# Altium schematic sheet connectors.SchDoc: AI ARTIQ Driver
size 420 x 297 mm; Author: G.Kasprowicz; CompanyName: CTI; Organization: CTI; Address1: CTI; Address2: Nowowiejska 15/19 00-665 Warsaw; Address3: gkasprow@gmail.com; DocumentNumber: 4; Revision: 1.0; SheetNumber: 4; SheetTotal: 11; ModifiedBy: -; CheckedDate: -; Title2: connectors; DivGrp: CTI; ModifiedDate: -; ProjectName: Sensor Box
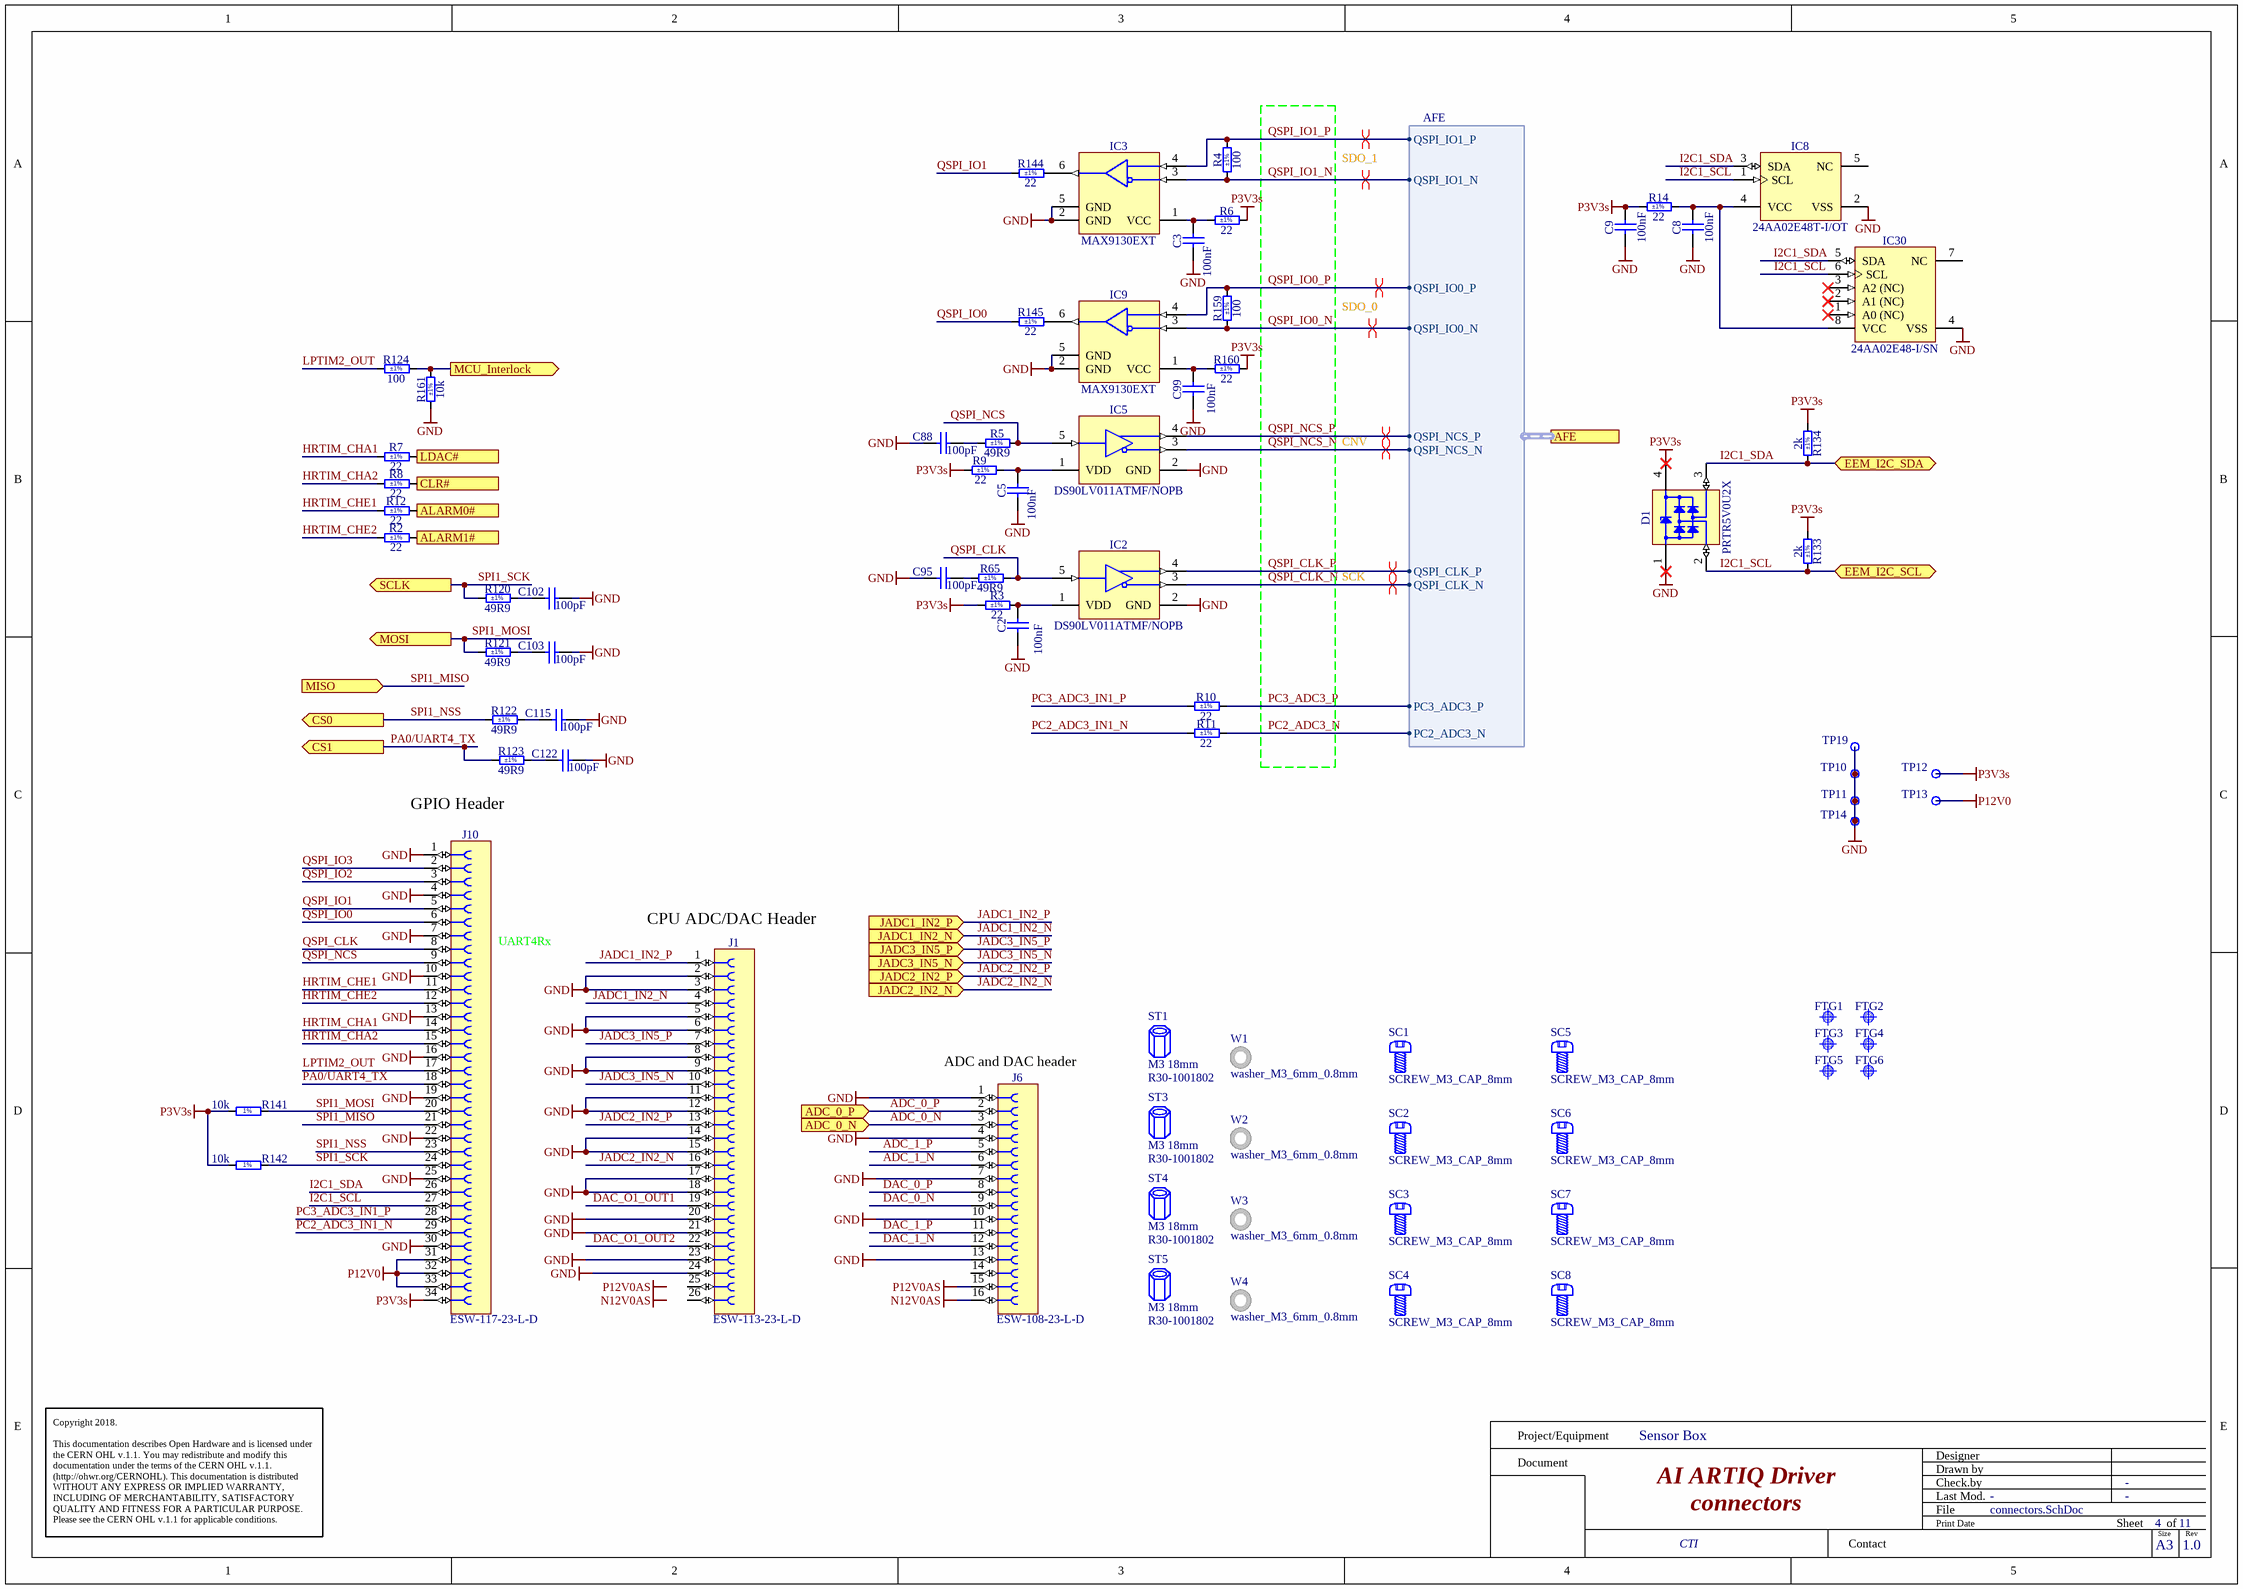
[diagram p0: connectors.SchDoc]

## Parts
C2  100nF  [CAPC2012X135N]
C3  100nF  [CAPC2012X135N]
C5  100nF  [CAPC2012X135N]
C8  100nF  [CAPC2012X135N]
C9  100nF  [CAPC2012X135N]
C88  100pF  [CAPC1005X55N]
C95  100pF  [CAPC1005X55N]
C99  100nF  [CAPC2012X135N]
C102  100pF  [CAPC1005X55N]
C103  100pF  [CAPC1005X55N]
C115  100pF  [CAPC1005X55N]
C122  100pF  [CAPC1005X55N]
D1  PRTR5V0U2X  [SOT190P230X110-4N]
FTG1  Use only in PCB  [FIDUCIAL_TOP_C100-200]  (value not drawn)  (no BOM)
FTG2  Use only in PCB  [FIDUCIAL_TOP_C100-200]  (value not drawn)  (no BOM)
FTG3  Use only in PCB  [FIDUCIAL_TOP_C100-200]  (value not drawn)  (no BOM)
FTG4  Use only in PCB  [FIDUCIAL_TOP_C100-200]  (value not drawn)  (no BOM)
FTG5  Use only in PCB  [FIDUCIAL_TOP_C100-200]  (value not drawn)  (no BOM)
FTG6  Use only in PCB  [FIDUCIAL_TOP_C100-200]  (value not drawn)  (no BOM)
IC2  DS90LV011ATMF/NOPB  [SOT95P284X122-5N]
IC3  MAX9130EXT  [SOT65P210X110-6N]
IC5  DS90LV011ATMF/NOPB  [SOT95P284X122-5N]
IC8  24AA02E48T-I/OT  [SOT95P280X145-5N]
IC9  MAX9130EXT  [SOT65P210X110-6N]
IC30  24AA02E48-I/SN  [SOIC127P600X175-8N]
J1  ESW-113-23-L-D  [ESW-113-23-L-D]
J6  ESW-108-23-L-D  [ESW-108-23-L-D]
J10  ESW-117-23-L-D  [ESW-117-23-L-D]
R2  22  Tolerance: ±1%  [RESC1608X55N]
R3  22  Tolerance: ±1%  [RESC1608X55N]
R4  100  Tolerance: ±1%  [RESC1608X55N]
R5  49R9  Tolerance: ±1%  [RESC1005X40N]
R6  22  Tolerance: ±1%  [RESC1608X55N]
R7  22  Tolerance: ±1%  [RESC1608X55N]
R8  22  Tolerance: ±1%  [RESC1608X55N]
R9  22  Tolerance: ±1%  [RESC1608X55N]
R10  22  Tolerance: ±1%  [RESC1608X55N]
R11  22  Tolerance: ±1%  [RESC1608X55N]
R12  22  Tolerance: ±1%  [RESC1608X55N]
R14  22  Tolerance: ±1%  [RESC1608X55N]
R65  49R9  Tolerance: ±1%  [RESC1005X40N]
R120  49R9  Tolerance: ±1%  [RESC1005X40N]
R121  49R9  Tolerance: ±1%  [RESC1005X40N]
R122  49R9  Tolerance: ±1%  [RESC1005X40N]
R123  49R9  Tolerance: ±1%  [RESC1005X40N]
R124  100  Tolerance: ±1%  [RESC1005X40N]
R133  2k  Tolerance: ±1%  [RESC1608X55N]
R134  2k  Tolerance: ±1%  [RESC1608X55N]
R141  10k  [RESC1005X40N]
R142  10k  [RESC1005X40N]
R144  22  Tolerance: ±1%  [RESC1608X55N]
R145  22  Tolerance: ±1%  [RESC1608X55N]
R159  100  Tolerance: ±1%  [RESC1608X55N]
R160  22  Tolerance: ±1%  [RESC1608X55N]
R161  10k  Tolerance: ±1%  [RESC1005X40N]
SC1  SCREW_M3_CAP_8mm  [SCREW_M3_CAP_8mm]  (mechanical)
SC2  SCREW_M3_CAP_8mm  [SCREW_M3_CAP_8mm]  (mechanical)
SC3  SCREW_M3_CAP_8mm  [SCREW_M3_CAP_8mm]  (mechanical)
SC4  SCREW_M3_CAP_8mm  [SCREW_M3_CAP_8mm]  (mechanical)
SC5  SCREW_M3_CAP_8mm  [SCREW_M3_CAP_8mm]  (mechanical)
SC6  SCREW_M3_CAP_8mm  [SCREW_M3_CAP_8mm]  (mechanical)
SC7  SCREW_M3_CAP_8mm  [SCREW_M3_CAP_8mm]  (mechanical)
SC8  SCREW_M3_CAP_8mm  [SCREW_M3_CAP_8mm]  (mechanical)
ST1  M3 18mm  [R30-1001802]  (mechanical)
ST3  M3 18mm  [R30-1001802]  (mechanical)
ST4  M3 18mm  [R30-1001802]  (mechanical)
ST5  M3 18mm  [R30-1001802]  (mechanical)
TP10  Test Point  [TPS127]  (value not drawn)  (no BOM)
TP11  Test Point  [TPS127]  (value not drawn)  (no BOM)
TP12  Test Point  [TPS127]  (value not drawn)  (no BOM)
TP13  Test Point  [TPS127]  (value not drawn)  (no BOM)
TP14  Test Point  [TPS127]  (value not drawn)  (no BOM)
TP19  Test Point  [VERO_20-313145]  (value not drawn)
W1  washer_M3_6mm_0.8mm  [washer_M3_6mm_0.8mm]  (mechanical)
W2  washer_M3_6mm_0.8mm  [washer_M3_6mm_0.8mm]  (mechanical)
W3  washer_M3_6mm_0.8mm  [washer_M3_6mm_0.8mm]  (mechanical)
W4  washer_M3_6mm_0.8mm  [washer_M3_6mm_0.8mm]  (mechanical)

## Ports
ADC_0_N (in), ADC_0_P (in), AFE (harness AFE), ALARM0# (in), ALARM1# (in), CLR# (out), CS0 (out), CS1 (out), EEM_I2C_SCL (bidir), EEM_I2C_SDA (bidir), JADC1_IN2_N (in), JADC1_IN2_P (in), JADC2_IN2_N (in), JADC2_IN2_P (in), JADC3_IN5_N (in), JADC3_IN5_P (in), LDAC# (out), MCU_Interlock (out), MISO (in), MOSI (out), SCLK (out)

## Harnesses
AFE: QSPI_IO1_P, QSPI_IO1_N, QSPI_IO0_P, QSPI_IO0_N, QSPI_NCS_P, QSPI_NCS_N, QSPI_CLK_P, QSPI_CLK_N, PC3_ADC3_P, PC2_ADC3_N

## Nets
GND: C2.1 C3.1 C5.1 C8.1 C9.1 C88.1 C95.1 C99.1 C102.2 C103.2 C115.2 C122.2 D1.1(GND) IC2.2(GND) IC3.2(GND) IC3.5(GND) IC5.2(GND) IC8.2(VSS) IC9.2(GND) IC9.5(GND) IC30.4(VSS) J1.2 J1.3 J1.5 J1.6 J1.8 J1.9 J1.11 J1.12 J1.14 J1.15 J1.17 J1.18 J1.20 J1.21 J1.23 J1.24 J6.1 J6.4 J6.7 J6.10 J6.13 J10.1 J10.4 J10.7 J10.10 J10.13 J10.16 J10.19 J10.22 J10.25 J10.30 R161.1 TP10.1 TP11.1 TP14.1 TP19.1
N12V0AS: J6.16
P3V3s: C9.2 D1.4(VCC) J10.34 R3.1 R6.2 R9.2 R14.1 R133.1 R134.1 R141.1 R142.1 R160.2 TP12.1
P12V0: J10.31 J10.32 J10.33 TP13.1
P12V0AS: J6.15
ADC_0_N: J6.3 ; port ADC_0_N
ADC_0_P: J6.2 ; port ADC_0_P
ADC_1_N: J6.6
ADC_1_P: J6.5
ALARM0#: R12.2 ; port ALARM0#
ALARM1#: R2.2 ; port ALARM1#
CLR#: R8.2 ; port CLR#
DAC_0_N: J6.9
DAC_0_P: J6.8
DAC_1_N: J6.12
DAC_1_P: J6.11
DAC_O1_OUT1: J1.19
DAC_O1_OUT2: J1.22
HRTIM_CHA1: J10.14 R7.1
HRTIM_CHA2: J10.15 R8.1
HRTIM_CHE1: J10.11 R12.1
HRTIM_CHE2: J10.12 R2.1
I2C1_SCL: D1.2(I/O1) IC8.1(SCL) IC30.6(SCL) J10.27 R133.2 ; port EEM_I2C_SCL
I2C1_SDA: D1.3(I/O2) IC8.3(SDA) IC30.5(SDA) J10.26 R134.2 ; port EEM_I2C_SDA
JADC1_IN2_N: J1.4 ; port JADC1_IN2_N
JADC1_IN2_P: J1.1 ; port JADC1_IN2_P
JADC2_IN2_N: J1.16 ; port JADC2_IN2_N
JADC2_IN2_P: J1.13 ; port JADC2_IN2_P
JADC3_IN5_N: J1.10 ; port JADC3_IN5_N
JADC3_IN5_P: J1.7 ; port JADC3_IN5_P
LDAC#: R7.2 ; port LDAC#
LPTIM2_OUT: J10.17 R124.1
MCU_Interlock: R124.2 R161.2 ; port MCU_Interlock
PA0/UART4_TX: J10.18 R123.1 ; port CS1
PC2_ADC3_IN1_N: J10.29 R11.1
PC2_ADC3_N: R11.2 ; port AFE.PC2_ADC3_N
PC3_ADC3_IN1_P: J10.28 R10.1
PC3_ADC3_P: R10.2 ; port AFE.PC3_ADC3_P
QSPI_CLK: IC2.5(TTLIN) J10.8 R65.2
QSPI_CLK_N: IC2.3(OUT-) ; port AFE.QSPI_CLK_N
QSPI_CLK_P: IC2.4(OUT+) ; port AFE.QSPI_CLK_P
QSPI_IO0: J10.6 R145.1
QSPI_IO0_N: IC9.3(IN-) R159.1 ; port AFE.QSPI_IO0_N
QSPI_IO0_P: IC9.4(IN+) R159.2 ; port AFE.QSPI_IO0_P
QSPI_IO1: J10.5 R144.1
QSPI_IO1_N: IC3.3(IN-) R4.1 ; port AFE.QSPI_IO1_N
QSPI_IO1_P: IC3.4(IN+) R4.2 ; port AFE.QSPI_IO1_P
QSPI_IO2: J10.3
QSPI_IO3: J10.2
QSPI_NCS: IC5.5(TTLIN) J10.9 R5.2
QSPI_NCS_N: IC5.3(OUT-) ; port AFE.QSPI_NCS_N
QSPI_NCS_P: IC5.4(OUT+) ; port AFE.QSPI_NCS_P
SPI1_MISO: J10.21 ; port MISO
SPI1_MOSI: J10.20 R121.1 R141.2 ; port MOSI
SPI1_NSS: J10.23 R122.1 ; port CS0
SPI1_SCK: J10.24 R120.1 R142.2 ; port SCLK
NetC2_2: C2.2 IC2.1(VDD) R3.2
NetC3_2: C3.2 IC3.1(VCC) R6.1
NetC5_2: C5.2 IC5.1(VDD) R9.1
NetC8_2: C8.2 IC8.4(VCC) IC30.8(VCC) R14.2
NetC88_2: C88.2 R5.1
NetC95_2: C95.2 R65.1
NetC99_2: C99.2 IC9.1(VCC) R160.1
NetC102_1: C102.1 R120.2
NetC103_1: C103.1 R121.2
NetC115_1: C115.1 R122.2
NetC122_1: C122.1 R123.2
NetIC3_6: IC3.6(OUT) R144.2
NetIC9_6: IC9.6(OUT) R145.2

Not connected (* = marked no-connect by the designer): IC8 5(NC); IC30 1(A0_(NC))* 2(A1_(NC))* 3(A2_(NC))* 7(NC); J1 25 26; J6 14

## Layout directives
differential pair: QSPI_CLK_N, QSPI_CLK_P, QSPI_IO0_N, QSPI_IO0_P, QSPI_IO1_N, QSPI_IO1_P, QSPI_NCS_N, QSPI_NCS_P

## Notes on the sheet
- SDO_1
- SDO_0
- CNV
- SCK
- GPIO Header
- (near J1) CPU ADC/DAC Header
- (near J10) UART4Rx
- (near J6) ADC and DAC header
- Labels drawn without touching a wire or pin: N12V0AS, P12V0AS
- Project/Equipment
- Document
- Designer
- Drawn by
- Check.by
- Copyright 2018.
  This documentation describes Open Hardware and is licensed under the CERN OHL v.1.1. You may redistribute and modify this documentation under the terms of the CERN OHL v.1.1. (http://ohwr.org/CERNOHL). This documentation is distributed WITHOUT ANY EXPRESS OR IMPLIED WARRANTY, INCLUDING OF MERCHANTABILITY, SATISFACTORY QUALITY AND FITNESS FOR A PARTICULAR PURPOSE. Please see the CERN OHL v.1.1 for applicable conditions.
- Contact
- File
- Last Mod.
- Print Date
- Sheet
- Size
- A3
- of
- Rev
- (in symbol R0402_10K_1%_0.0625W_100PPM) 1%

## Library data of the parts
C2 C3 C5 C8 C9 C99 = CC0805_100NF_50V_10%_X7R: Non-polarised capacitor; Part Description: SMD Multilayer Chip Ceramic Capacitor; Manufacturer: GENERIC; Manufacturer1 Part Number: C2012X7R1H104K085AA; Voltage: 50V; TC: X7R; Tolerance: ±10%; Part Number: CC0805_100NF_50V_10%_X7R; Component Kind: Standard; Component Type: Standard; Pin Count: 2; Value: 100nF; Status: Preferred; Manufacturer Part Number: CC0805_100NF_50V_10%_X7R; Case: 0805; Mounted: Yes; Socket: No; SMD: Yes; Sense: No; Manufacturer1 Example: TDK; Manufacturer1 ComponentHeight: 1mm; HelpURL: \\cern.ch\dfs\Applications\Altium\Datasheets\CC0805_X7R_TDK_C.pdf; Author: CERN DEM JLC; CreateDate: 03.12.2007; LatestRevisionDate: 22.04.2015
C88 C95 C102 C103 C115 C122 = CC0402_100PF_50V_5%_C0G: Non-polarised capacitor; Part Description: SMD Multilayer Chip Ceramic Capacitor; Manufacturer: GENERIC; Manufacturer1 Part Number: C0402C101J5GACTU; Voltage: 50V; TC: C0G/NP0; Tolerance: ±5%; Part Number: CC0402_100PF_50V_5%_C0G; Component Kind: Standard; Component Type: Standard; Pin Count: 2; Value: 100pF; Status: Preferred; Manufacturer Part Number: CC0402_100PF_50V_5%_C0G; Case: 0402; Mounted: Yes; Socket: No; SMD: Yes; Sense: No; Manufacturer1 Example: KEMET; Manufacturer1 ComponentHeight: 0.55mm; HelpURL: \\cern.ch\dfs\Applications\Altium\Datasheets\CC0402_C0G_KEMET_(Commercial Grade).pdf; Author: CERN DEM JLC; CreateDate: 03.12.2007; LatestRevisionDate: 22.04.2015
D1 = PRTR5V0U2X: Ultra Low Capacitance Double Rail-to-Rail ESD Protection Diode; Part Description: Ultra Low Capacitance (1pF) Double Rail-to-Rail ESD Protection Diode (8kV); Manufacturer: NXP SEMICONDUCTORS; Voltage: 5.5V; PressFit: No; Bonding: No; Part Number: PRTR5V0U2X; Component Kind: Standard; Component Type: Standard; Device: PRTR5V0U2X; PackageDescription: SOT143B, SOT, 1.90mm Pitch; 4 Pin, 1.30mm W X 2.90mm L X 1.10mm H body, IPC Medium Density; Manufacturer Part Number: PRTR5V0U2X; Pin Count: 4; Case: SOT143B; Mounted: Yes; Socket: No; SMD: Yes; Sense: No; ComponentHeight: 1.1mm; HelpURL: \\cern.ch\dfs\Applications\Altium\Datasheets\PRTR5V0U2X.pdf; Author: CERN DEM JLC; CreateDate: 22.03.2011; LatestRevisionDate: 22.03.2011
FTG1-FTG6 = FIDUCIAL_TARGET_C100-200: Fiducial Target; Part Description: Round Fiducial Target, Top Layer, 1.0mm, Top Solder 2.0mm, Keepout =2.0mm; Mounted: No; Part Number: FIDUCIAL_TARGET_C100-200; Component Type: Standard (No BOM); Pin Count: 1; Family: Fiducial; Socket: No; SMD: Yes; Sense: No; Status: None; ComponentHeight: 0mm; HelpURL: Undefined; Author: CERN DEM JLC; CreateDate: 09/02/2010; LatestRevisionDate: 04/04/2012; PackageDescription: Round Fiducial Target, Top Layer, 1.0mm, Top Solder 2.0mm, Keepout =2.0mm
IC2 IC5 = DS90LV011ATMF/NOPB: 3V LVDS Single High Speed Differential Driver; Manufacturer: NATIONAL SEMICONDUCTOR; PressFit: No; Bonding: No; Part Number: DS90LV011ATMF/NOPB; Component Kind: Standard; Component Type: Standard; Device: DS90LV011ATMF/NOPB; PackageDescription: SOT, 0.95mm Pitch; 5 Pin, 1.67mm W X 2.99mm L X 1.22mm H body, IPC Medium Density; Part Description: 3V LVDS Single High Speed Differential Driver; Manufacturer Part Number: DS90LV011ATMF; Pin Count: 5; Case: SOT23-5; Mounted: Yes; Socket: No; SMD: Yes; Sense: No; ComponentHeight: 1.19mm; Author: CERN DEM JLC; HelpURL: \\cern.ch\dfs\Applications\Altium\Datasheets\DS90LV011ATMF-NOPB.pdf; CreateDate: 25.04.2012; LatestRevisionDate: 01.06.2022
IC3 IC9 = MAX9130EXT: Single 500Mbps LVDS Line Receiver; Manufacturer: MAXIM; PressFit: No; Bonding: No; Part Number: MAX9130EXT; Component Kind: Standard; Component Type: Standard; Device: MAX9130EXT; PackageDescription: SOT363, SC70-6, SOT, 0.65mm Pitch, 6 Pin, 1.25mm W X 2.00mm L X 1.10mm H, IPC Medium Density; Part Description: Single 500Mbps LVDS Line Receiver; Manufacturer Part Number: MAX9130EXT; Pin Count: 6; Case: SOT363; Mounted: Yes; Socket: No; SMD: Yes; Sense: No; ComponentHeight: 1.1mm; Author: CERN DEM HF; HelpURL: \\cern.ch\dfs\Applications\Altium\Datasheets\MAX9130EXT.pdf; CreateDate: 18.05.2022; LatestRevisionDate: 18.05.2022
IC8 = 24AA02E48T-I/OT: 1.7V-5.5V, 2K I2C Serial EEPROM With EUI-48 Node Identity; Manufacturer: MICROCHIP TECHNOLOGY; PressFit: No; Bonding: No; Part Number: 24AA02E48T-I/OT; Component Kind: Standard; Component Type: Standard; Device: 24AA02E48T-I/OT; PackageDescription: SOT, 0.95mm pitch; 5 pin, 1.60mm W X 2.90mm L X 1.45mm H body, IPC Medium Density; Part Description: 1.7V-5.5V, 2K I2C Serial EEPROM With EUI-48 Node Identity; Manufacturer Part Number: 24AA02E48T-I/OT; Pin Count: 5; Case: SOT23-5; Mounted: Yes; Socket: No; SMD: Yes; Sense: No; ComponentHeight: 1.45mm; HelpURL: \\cern.ch\dfs\Applications\Altium\Datasheets\24AA02E48T-I-OT.pdf; Author: CERN DEM MR; CreateDate: 31.03.2016; LatestRevisionDate: 31.03.2016
IC30 = MEM_24AA02E48-I/SN: 1.7V-5.5V, 2K I2C™ Serial EEPROMs with EUI-48™ Node Identity; Manufacturer: MICROCHIP TECHNOLOGY; PressFit: No; Bonding: No; Part Number: 24AA02E48-I/SN; Component Kind: Standard; Component Type: Standard; Device: 24AA02E48-I/SN; PackageDescription: SOIC, 1.27mm Pitch; 8 Pin - Body 4x5mm, IPC Medium Density; Part Description: 1.7V-5.5V, 2K I2C™ Serial EEPROMs with EUI-48™ Node Identity; Manufacturer Part Number: 24AA02E48-I/SN; Pin Count: 8; Case: SOIC8; Mounted: Yes; Socket: No; SMD: Yes; Sense: No; ComponentHeight: 1.75mm; HelpURL: \\cern.ch\dfs\Applications\Altium\Datasheets\24AA025E48-I-SN.pdf; Author: CERN DEM MR; CreateDate: 19.07.2016; LatestRevisionDate: 19.07.2016
J1 = ESW-113-23-L-D: Connector Elevated Socket 26 POS 2.54mm, 13.59mm height; Manufacturer: Samtec; Manufacturer Part Number: ESW-113-23-L-D
J6 = ESW-108-23-L-D: Connector Elevated Socket 16 POS 2.54mm, 13.59mm height; Manufacturer: Samtec; Manufacturer Part Number: ESW-108-23-L-D
J10 = ESW-117-23-L-D: Connector Elevated Socket 34 POS 2.54mm, 13.59mm height; Manufacturer: Samtec; Manufacturer Part Number: ESW-117-23-L-D
R2 R3 R6-R12 R14 R144 R145 R160 = R0603_22R_1%_0.1W_100PPM: Resistor - 1%; Part Description: General Purpose Thick Film Chip Resistor; Manufacturer: GENERIC; Manufacturer1 Part Number: NRC06F22R0TRF; Power: 0.1W; TC: ±100ppm/°C; PressFit: No; Part Number: R0603_22R_1%_0.1W_100PPM; Component Kind: Standard; Component Type: Standard; Pin Count: 2; Value: 22; Status: Preferred; Manufacturer Part Number: R0603_22R_1%_0.1W_100PPM; Case: 0603; Mounted: Yes; Sense: No; Socket: No; SMD: Yes; Manufacturer1 Example: NIC COMPONENT; Manufacturer1 ComponentHeight: 0.55mm; HelpURL: \\cern.ch\dfs\Applications\Altium\Datasheets\R0603_NIC_NRC.pdf; Author: CERN DEM JLC; CreateDate: 03.12.2007; LatestRevisionDate: 13.03.2008
R4 R159 = R0603_100R_1%_0.1W_100PPM: Resistor - 1%; Part Description: General Purpose Thick Film Chip Resistor; Manufacturer: GENERIC; Manufacturer1 Part Number: NRC06F4700TRF; Power: 0.1W; TC: ±100ppm/°C; PressFit: No; Part Number: R0603_100R_1%_0.1W_100PPM; Component Kind: Standard; Component Type: Standard; Pin Count: 2; Value: 100; Status: Preferred; Manufacturer Part Number: R0603_100R_1%_0.1W_100PPM; Case: 0603; Mounted: Yes; Sense: No; Socket: No; SMD: Yes; Manufacturer1 Example: NIC COMPONENT; Manufacturer1 ComponentHeight: 0.55mm; HelpURL: \\cern.ch\dfs\Applications\Altium\Datasheets\R0603_NIC_NRC.pdf; Author: CERN DEM JLC; CreateDate: 03.12.2007; LatestRevisionDate: 13.03.2008
R5 R65 R120-R123 = R0402_49R9_1%_0.0625W_100PPM: Resistor - 1%; Part Description: General Purpose Thick Film Chip Resistor; Manufacturer: GENERIC; Manufacturer1 Part Number: 232270674999L or RC0402FR-0749R9L; TC: ±100ppm/°C; PressFit: No; Part Number: R0402_49R9_1%_0.0625W_100PPM; Component Kind: Standard; Component Type: Standard; Pin Count: 2; Value: 49R9; Status: Not Recommended; Power: 0.0625W; Manufacturer Part Number: R0402_49R9_1%_0.0625W_100PPM; Case: 0402; Mounted: Yes; Sense: No; Socket: No; SMD: Yes; Manufacturer1 Example: YAGEO PHYCOMP; Manufacturer1 ComponentHeight: 0.4mm; HelpURL: \\cern.ch\dfs\Applications\Altium\Datasheets\R0402_Phycomp_RC0402.pdf; Author: CERN DEM JLC; CreateDate: 24.10.2012; LatestRevisionDate: 24.10.2012
R124 = R0402_100R_1%_0.0625W_100PPM: Resistor - 1%; Part Description: General Purpose Thick Film Chip Resistor; Manufacturer: GENERIC; Manufacturer1 Part Number: 232270671001L; TC: ±100ppm/°C; PressFit: No; Part Number: R0402_100R_1%_0.0625W_100PPM; Component Kind: Standard; Component Type: Standard; Pin Count: 2; Value: 100; Status: Not Recommended; Power: 0.0625W; Manufacturer Part Number: R0402_100R_1%_0.0625W_100PPM; Case: 0402; Mounted: Yes; Sense: No; Socket: No; SMD: Yes; Manufacturer1 Example: YAGEO PHYCOMP; Manufacturer1 ComponentHeight: 0.4mm; HelpURL: \\cern.ch\dfs\Applications\Altium\Datasheets\R0402_Phycomp_RC0402.pdf; Author: CERN DEM JLC; CreateDate: 03.12.2007; LatestRevisionDate: 17.10.2012
R133 R134 = R0603_2K_1%_0.1W_100PPM: Resistor - 1%; Part Description: General Purpose Thick Film Chip Resistor; Manufacturer: GENERIC; Manufacturer1 Part Number: NRC06F2001TRF; Power: 0.1W; TC: ±100ppm/°C; PressFit: No; Part Number: R0603_2K_1%_0.1W_100PPM; Component Kind: Standard; Component Type: Standard; Pin Count: 2; Value: 2k; Status: Preferred; Manufacturer Part Number: R0603_2K_1%_0.1W_100PPM; Case: 0603; Mounted: Yes; Sense: No; Socket: No; SMD: Yes; Manufacturer1 Example: NIC COMPONENT; Manufacturer1 ComponentHeight: 0.55mm; HelpURL: \\cern.ch\dfs\Applications\Altium\Datasheets\R0603_NIC_NRC.pdf; Author: CERN DEM JLC; CreateDate: 03.12.2007; LatestRevisionDate: 13.03.2008
R141 R142 R161 = R0402_10K_1%_0.0625W_100PPM: Resistor - 1%; Part Description: General Purpose Thick Film Chip Resistor; Manufacturer: GENERIC; Manufacturer1 Part Number: 232270671003L; TC: ±100ppm/°C; PressFit: No; Part Number: R0402_10K_1%_0.0625W_100PPM; Component Kind: Standard; Component Type: Standard; Pin Count: 2; Value: 10k; Status: Not Recommended; Power: 0.0625W; Manufacturer Part Number: R0402_10K_1%_0.0625W_100PPM; Case: 0402; Mounted: Yes; Sense: No; Socket: No; SMD: Yes; Manufacturer1 Example: YAGEO PHYCOMP; Manufacturer1 ComponentHeight: 0.4mm; HelpURL: \\cern.ch\dfs\Applications\Altium\Datasheets\R0402_Phycomp_RC0402.pdf; Author: CERN DEM JLC; CreateDate: 03.12.2007; LatestRevisionDate: 17.10.2012
  R141 R142: Tolerance: ±1%
SC1-SC8 = SCREW_M3_CAP_8mm: M3 x 8mm cap head screw; Manufacturer: Accu Limited; Manufacturer Part Number: SSCF-M3-8-12.9-Z
ST1 ST3-ST5 = STANDOFF_HARWIN_R30_1001802: M3.0x18 standoff; Manufacturer: Harwin; Manufacturer Part Number: R30-1001802
TP10-TP14 = SMD_PAD_1.27X1.27MM: Part Description: 1.27mm x 1.27mm PCB Copper Area (SMD Test Point); Mounted: No; Part Number: SMD_PAD_1.27X1.27MM; Component Type: Standard (No BOM); Pin Count: 1; Family: Test Point; Socket: No; SMD: No; Sense: No; Status: None; ComponentHeight: 0mm; HelpURL: Undefined; Author: CERN DEM JLC; CreateDate: 12.01.2008; LatestRevisionDate: 12.01.2008; PackageDescription: 1.27mm x 1.27mm PCB Copper Area (SMD Test Point)
TP19 = VERO_20-313145: Part Description: Black Bead PCB Terminal Test Pin for 2.4mm PCB Thickness (1.32mm Hole); Manufacturer: VERO TECHNOLOGIES; PressFit: No; Part Number: VERO_20-313145; Component Kind: Standard; Component Type: Standard; Pin Count: 1; Family: Test Point; Mounted: Yes; Socket: No; SMD: No; Sense: No; Status: None; Manufacturer Part Number: 20-313145; ComponentHeight: 5.3mm; HelpURL: \\cern.ch\dfs\Applications\Altium\Datasheets\VERO_20-313145.pdf; Author: CERN DEM JLC; CreateDate: 15.07.2013; LatestRevisionDate: 15.07.2013
W1-W4 = washer_M3_6mm_0.8mm: M3 Washer: / ID: 3.2mm / OD: 6mm / Thickness 0.8mm; Manufacturer: Accu Limited; Manufacturer Part Number: HAFZ-M3-A4